# Altium schematic sheet NB3000_CS4270_Audio_Codec.SchDoc
size A
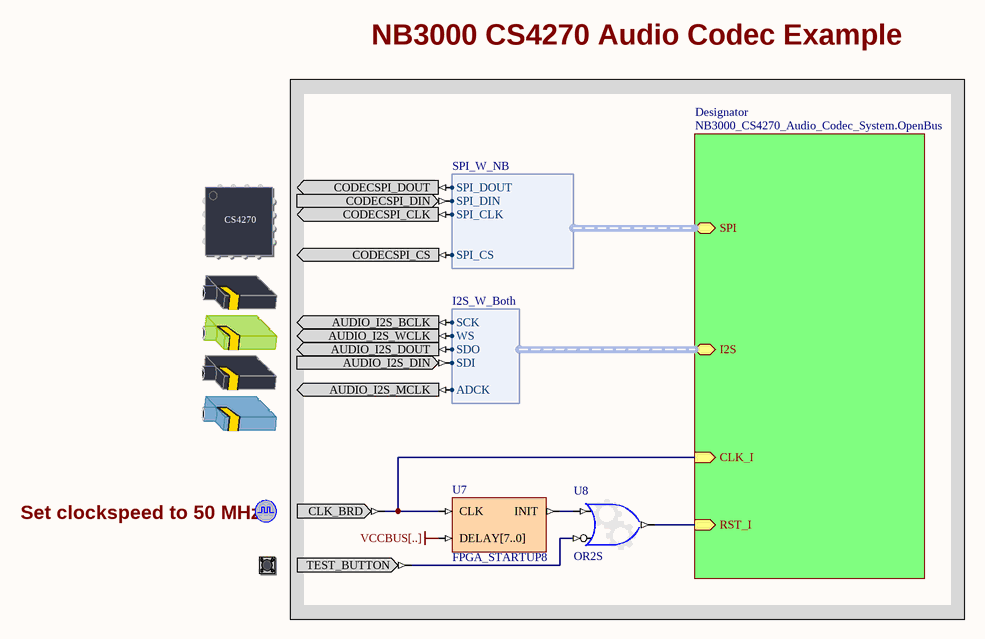
[diagram p0: NB3000_CS4270_Audio_Codec.SchDoc]

## Parts
(Parts that share a designator on the sheet are numbered #1, #2 ... from top to bottom, then left to right.)
?#1  AUDIO_CODEC_CTRL  (value not drawn)
?#2  AUDIO_CODEC  (value not drawn)
?#3  CLOCK_BOARD  (value not drawn)
?#4  TEST_BUTTON  (value not drawn)
U7  FPGA_STARTUP8
U8  OR2S

## Sub-sheets
Designator = NB3000_CS4270_Audio_Codec_System.OpenBus: RST_I (in), CLK_I (in), I2S (harness I2S_W_Both), SPI (harness SPI_W_NB)

## Harnesses
I2S_W_Both: SCK, WS, SDO, SDI, ADCK
SPI_W_NB: SPI_DOUT, SPI_DIN, SPI_CLK, SPI_CS

## Nets
VCCBUS[..]: U7.DELAY[7..0]
Net?#1_CODECSPI_CLK: ?#1.CODECSPI_CLK ; sheet Designator/SPI.SPI_CLK
Net?#1_CODECSPI_CS: ?#1.CODECSPI_CS ; sheet Designator/SPI.SPI_CS
Net?#1_CODECSPI_DIN: ?#1.CODECSPI_DIN ; sheet Designator/SPI.SPI_DIN
Net?#1_CODECSPI_DOUT: ?#1.CODECSPI_DOUT ; sheet Designator/SPI.SPI_DOUT
Net?#2_AUDIO_I2S_BCLK: ?#2.AUDIO_I2S_BCLK ; sheet Designator/I2S.SCK
Net?#2_AUDIO_I2S_DIN: ?#2.AUDIO_I2S_DIN ; sheet Designator/I2S.SDI
Net?#2_AUDIO_I2S_DOUT: ?#2.AUDIO_I2S_DOUT ; sheet Designator/I2S.SDO
Net?#2_AUDIO_I2S_MCLK: ?#2.AUDIO_I2S_MCLK ; sheet Designator/I2S.ADCK
Net?#2_AUDIO_I2S_WCLK: ?#2.AUDIO_I2S_WCLK ; sheet Designator/I2S.WS
Net?#3_CLK_BRD: ?#3.CLK_BRD U7.CLK ; sheet Designator/CLK_I
Net?#4_TEST_BUTTON: ?#4.TEST_BUTTON U8.I1
NetU7_INIT: U7.INIT U8.I0
NetU8_O: U8.O ; sheet Designator/RST_I

## Notes on the sheet
- NB3000 CS4270 Audio Codec Example
- Set clockspeed to 50 MHz
- (in symbol AUDIO_CODEC_CTRL) CS4270

## Library data of the parts
?#1 = AUDIO_CODEC_CTRL: Audio Codec Control; PortComponent: True; Published: 22-Jan-2007; Publisher: Altium Limited; HelpURL: https://wiki.altium.com/display/ADOH/NanoBoard+3000+-+Audio+CODEC
?#2 = AUDIO_CODEC: Audio Codec; PortComponent: True; IncludeInDSF: AUDIO_CS4270; Published: 22-Jan-2007; Publisher: Altium Limited; HelpURL: https://wiki.altium.com/display/ADOH/NanoBoard+3000+-+Audio+CODEC
?#3 = CLOCK_BOARD: Global System Clock Supply; PortComponent: True; Published: 19-Nov-2003; Publisher: Altium Limited; HelpURL: TR0143 Technical Reference Manual for Altium's Desktop NanoBoard NB2DSK01.pdf#page=41; UseInDSF: True
?#4 = TEST_BUTTON: Test / Reset Button; PortComponent: True; Published: 19-Nov-2003; Publisher: Altium Limited; HelpURL: TR0143 Technical Reference Manual for Altium's Desktop NanoBoard NB2DSK01.pdf#page=53
U7 = FPGA_STARTUP8: FPGA Startup With 8 Bit Delay; Published: 9-Dec-2004; Publisher: Altium Limited; HelpURL: CR0119 FPGA_STARTUPx Powerup Delay Unit.pdf; LastRevisionNo: 1.00.00; ComponentLink1Description: Core &Resource Usage; ComponentLink1URL: CR0139 FPGA Peripheral Resource Usage.pdf#page=11
U8 = GATE: Configurable Generic Gate; ConfiguratorName: GENERIC_GATE; ConfigurationParameters: {}Version[1.0]{}GateKind[OR]{}BusInput[False]{}GateInputType[Bit]{}GateOutputOption[Normal]{}BusWidth[8]{}RegisterOutputs[False]{}NegativeClockEdge[False]{}InputCount[2]{}InputInvert0[False]{}InputInvert1[True]{}; LastRevisionNo: 1.00.00; Published: 3-Sep-2008; Publisher: Altium Limited